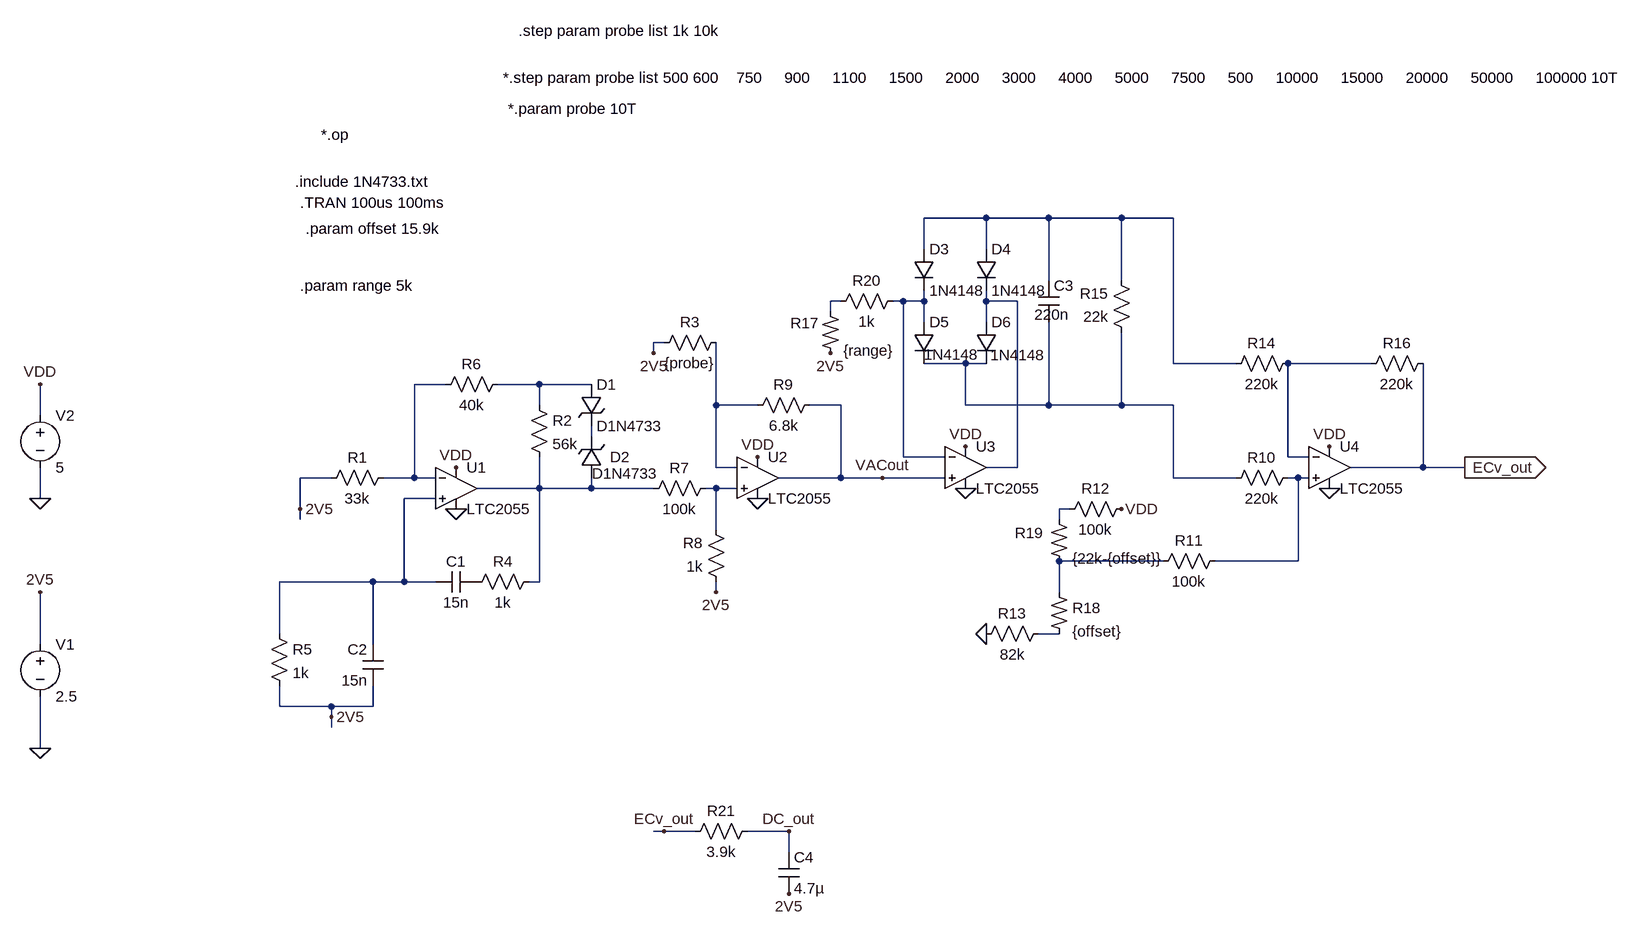
[diagram p0: schematic Conductivity5V.asc]
Conductivity5V.asc, the LTspice schematic file:
Version 4
SHEET 1 2084 992
WIRE 1120 -160 1024 -160
WIRE 1216 -160 1120 -160
WIRE 1328 -160 1216 -160
WIRE 1408 -160 1328 -160
WIRE 1024 -112 1024 -160
WIRE 1120 -112 1120 -160
WIRE 1216 -64 1216 -160
WIRE 1328 -64 1328 -160
WIRE 896 -32 880 -32
WIRE 992 -32 976 -32
WIRE 1024 -32 1024 -48
WIRE 1024 -32 992 -32
WIRE 1120 -32 1120 -48
WIRE 1168 -32 1120 -32
WIRE 880 -16 880 -32
WIRE 1024 0 1024 -32
WIRE 1120 0 1120 -32
WIRE 624 32 608 32
WIRE 608 48 608 32
WIRE 1088 64 1024 64
WIRE 1120 64 1088 64
WIRE 1408 64 1408 -160
WIRE 1504 64 1408 64
WIRE 1712 64 1584 64
WIRE 288 96 240 96
WIRE 432 96 368 96
WIRE 512 96 432 96
WIRE -336 128 -336 96
WIRE 432 128 432 96
WIRE 704 128 704 32
WIRE 768 128 704 128
WIRE 896 128 848 128
WIRE 1088 128 1088 64
WIRE 1216 128 1216 0
WIRE 1216 128 1088 128
WIRE 1328 128 1328 16
WIRE 1328 128 1216 128
WIRE 1408 128 1328 128
WIRE -336 144 -336 128
WIRE 512 176 512 160
WIRE 992 208 992 -32
WIRE 1056 208 992 208
WIRE 1584 208 1584 64
WIRE 1616 208 1584 208
WIRE 704 224 704 128
WIRE 736 224 704 224
WIRE 1168 224 1168 -32
WIRE 1168 224 1120 224
WIRE 1792 224 1792 64
WIRE 1792 224 1680 224
WIRE 1856 224 1792 224
WIRE 112 240 64 240
WIRE 240 240 240 96
WIRE 240 240 192 240
WIRE 272 240 240 240
WIRE 896 240 896 128
WIRE 896 240 800 240
WIRE 960 240 896 240
WIRE 1056 240 960 240
WIRE 1408 240 1408 128
WIRE 1504 240 1408 240
WIRE 1600 240 1584 240
WIRE 1616 240 1600 240
WIRE 432 256 432 208
WIRE 432 256 336 256
WIRE 512 256 512 240
WIRE 512 256 432 256
WIRE 608 256 512 256
WIRE 704 256 688 256
WIRE 736 256 704 256
WIRE -336 272 -336 224
WIRE 272 272 224 272
WIRE 64 288 64 240
WIRE 1248 288 1232 288
WIRE 64 304 64 288
WIRE 1232 304 1232 288
WIRE 704 320 704 256
WIRE 1392 368 1232 368
WIRE 1600 368 1600 240
WIRE 1600 368 1472 368
WIRE 176 400 32 400
WIRE 224 400 224 272
WIRE 224 400 176 400
WIRE 272 400 224 400
WIRE 432 400 432 256
WIRE 432 400 416 400
WIRE 704 416 704 400
WIRE 1232 416 1232 368
WIRE 32 480 32 400
WIRE 1232 480 1200 480
WIRE -336 496 -336 416
WIRE 176 496 176 400
WIRE 32 592 32 560
WIRE 112 592 32 592
WIRE 176 592 176 560
WIRE 176 592 112 592
WIRE 112 608 112 592
WIRE 112 624 112 608
WIRE -336 656 -336 576
WIRE 624 784 608 784
WIRE 672 784 624 784
WIRE 816 784 752 784
WIRE 816 816 816 784
FLAG 64 288 2V5
FLAG 112 608 2V5
FLAG 704 416 2V5
FLAG 608 48 2V5
FLAG -336 96 VDD
FLAG 304 224 VDD
FLAG 768 208 VDD
FLAG -336 272 0
FLAG 304 288 0
FLAG 768 272 0
FLAG 960 240 VACout
FLAG 1088 192 VDD
FLAG 1648 192 VDD
FLAG 1328 288 VDD
FLAG 1120 480 0
FLAG 1088 256 0
FLAG 1648 256 0
FLAG 1856 224 ECv_out
IOPIN 1856 224 Out
FLAG 880 48 2V5
FLAG 816 880 2V5
FLAG 624 784 ECv_out
FLAG 816 784 DC_out
FLAG -336 656 0
FLAG -336 416 2V5
DATAFLAG -336 128 "$"
DATAFLAG -336 128 "$"
SYMBOL res 208 224 R90
WINDOW 0 0 56 VBottom 2
WINDOW 3 32 56 VTop 2
SYMATTR InstName R1
SYMATTR Value 33k
SYMBOL res 416 112 R0
SYMATTR InstName R2
SYMATTR Value 56k
SYMBOL res 432 384 R90
WINDOW 0 0 56 VBottom 2
WINDOW 3 32 56 VTop 2
SYMATTR InstName R4
SYMATTR Value 1k
SYMBOL res 16 464 R0
SYMATTR InstName R5
SYMATTR Value 1k
SYMBOL cap 336 384 R90
WINDOW 0 0 32 VBottom 2
WINDOW 3 32 32 VTop 2
SYMATTR InstName C1
SYMATTR Value 15n
SYMBOL cap 192 560 R180
WINDOW 0 24 56 Left 2
WINDOW 3 24 8 Left 2
SYMATTR InstName C2
SYMATTR Value 15n
SYMBOL res 704 240 R90
WINDOW 0 0 56 VBottom 2
WINDOW 3 32 56 VTop 2
SYMATTR InstName R7
SYMATTR Value 100k
SYMBOL res 720 416 R180
WINDOW 0 36 76 Left 2
WINDOW 3 36 40 Left 2
SYMATTR InstName R8
SYMATTR Value 1k
SYMBOL res 752 144 R270
WINDOW 0 32 56 VTop 2
WINDOW 3 0 56 VBottom 2
SYMATTR InstName R9
SYMATTR Value 6.8k
SYMBOL zener 496 96 R0
SYMATTR InstName D1
SYMATTR Value D1N4733
SYMBOL zener 528 240 R180
WINDOW 0 -13 32 Right 2
WINDOW 3 15 7 Right 2
SYMATTR InstName D2
SYMATTR Value D1N4733
SYMBOL voltage -336 128 R0
SYMATTR InstName V2
SYMATTR Value 5
SYMBOL res 1600 224 R90
WINDOW 0 0 56 VBottom 2
WINDOW 3 32 56 VTop 2
SYMATTR InstName R10
SYMATTR Value 220k
SYMBOL res 1488 352 R90
WINDOW 0 0 56 VBottom 2
WINDOW 3 32 56 VTop 2
SYMATTR InstName R11
SYMATTR Value 100k
SYMBOL res 1344 272 R90
WINDOW 0 0 56 VBottom 2
WINDOW 3 32 56 VTop 2
SYMATTR InstName R12
SYMATTR Value 100k
SYMBOL res 1216 464 R90
WINDOW 0 0 56 VBottom 2
WINDOW 3 32 56 VTop 2
SYMATTR InstName R13
SYMATTR Value 82k
SYMBOL res 1600 48 R90
WINDOW 0 0 56 VBottom 2
WINDOW 3 32 56 VTop 2
SYMATTR InstName R14
SYMATTR Value 220k
SYMBOL res 1344 32 R180
WINDOW 0 36 76 Left 2
WINDOW 3 36 40 Left 2
SYMATTR InstName R15
SYMATTR Value 22k
SYMBOL res 1696 80 R270
WINDOW 0 32 56 VTop 2
WINDOW 3 0 56 VBottom 2
SYMATTR InstName R16
SYMATTR Value 220k
SYMBOL cap 1200 -64 R0
WINDOW 3 -6 53 Left 2
SYMATTR InstName C3
SYMATTR Value 220n
SYMBOL diode 1008 -112 R0
SYMATTR InstName D3
SYMATTR Value 1N4148
SYMBOL diode 1104 -112 R0
SYMATTR InstName D4
SYMATTR Value 1N4148
SYMBOL diode 1008 0 R0
WINDOW 3 16 50 Left 2
SYMATTR InstName D5
SYMATTR Value 1N4148
SYMBOL diode 1104 0 R0
WINDOW 3 22 51 Left 2
SYMATTR InstName D6
SYMATTR Value 1N4148
SYMBOL res2 864 -16 R0
WINDOW 0 -1 18 Right 2
SYMATTR InstName R17
SYMATTR Value {range}
SYMBOL res2 1216 416 R0
SYMATTR InstName R18
SYMATTR Value {offset}
SYMBOL res2 1216 304 R0
WINDOW 0 -52 21 Left 2
SYMATTR InstName R19
SYMATTR Value {22k-{offset}}
SYMBOL res 992 -48 R90
WINDOW 0 0 56 VBottom 2
WINDOW 3 32 56 VTop 2
SYMATTR InstName R20
SYMATTR Value 1k
SYMBOL res 720 16 R90
WINDOW 0 0 56 VBottom 2
WINDOW 3 32 56 VTop 2
SYMATTR InstName R3
SYMATTR Value {probe}
SYMBOL res 272 112 R270
WINDOW 0 32 56 VTop 2
WINDOW 3 0 56 VBottom 2
SYMATTR InstName R6
SYMATTR Value 40k
SYMBOL res 768 768 R90
WINDOW 0 0 56 VBottom 2
WINDOW 3 32 56 VTop 2
SYMATTR InstName R21
SYMATTR Value 3.9k
SYMBOL cap 800 816 R0
SYMATTR InstName C4
SYMATTR Value 4.7µ
SYMBOL Opamps/LTC2055 304 256 R0
SYMATTR InstName U1
SYMBOL Opamps/LTC2055 768 240 R0
SYMATTR InstName U2
SYMBOL Opamps/LTC2055 1088 224 R0
SYMATTR InstName U3
SYMBOL Opamps/LTC2055 1648 224 R0
SYMATTR InstName U4
SYMBOL voltage -336 480 R0
SYMATTR InstName V1
SYMATTR Value 2.5
TEXT 56 -216 Left 2 !.include 1N4733.txt
TEXT 64 -184 Left 2 !.TRAN 100us 100ms
TEXT 72 -144 Left 2 !.param offset 15.9k
TEXT 376 -376 Left 2 !*.step param probe list 500 600	750	 900 	1100 	1500	 2000 	3000	 4000	 5000	 7500	 500	 10000 	15000	 20000	 50000	 100000 10T
TEXT 64 -56 Left 2 !.param range 5k
TEXT 96 -288 Left 2 !*.op
TEXT 384 -328 Left 2 !*.param probe 10T
TEXT 400 -448 Left 2 !.step param probe list 1k 10k

The netlist it stands for:
* Conductivity5V.asc
R1 N007 2V5 33k
R2 N008 N012 56k
R4 N012 P001 1k
R5 N014 2V5 1k
C1 P001 N014 15n
C2 2V5 N014 15n
R7 N013 N012 100k
R8 2V5 N013 1k
R9 N009 VACout 6.8k
D1 N008 N010 D1N4733
D2 N012 N010 D1N4733
V2 VDD 0 5
R10 N011 N005 220k
R11 N011 N016 100k
R12 VDD N015 100k
R13 N017 0 82k
R14 N006 N001 220k
R15 N005 N001 22k
R16 N006 ECv_out 220k
C3 N001 N005 220n
D3 N001 N003 1N4148
D4 N001 N004 1N4148
D5 N003 N005 1N4148
D6 N004 N005 1N4148
R17 N002 2V5 {range}
R18 N016 N017 {offset}
R19 N015 N016 {22k-{offset}}
R20 N003 N002 1k
R3 N009 2V5 {probe}
R6 N007 N008 40k
R21 DC_out ECv_out 3.9k
C4 DC_out 2V5 4.7µ
XU1 N014 N007 N012 VDD 0 LTC2054  ; LTC2055, pins In+ In- OUT V+ V-
XU2 N013 N009 VACout VDD 0 LTC2054  ; LTC2055, pins In+ In- OUT V+ V-
XU3 VACout N003 N004 VDD 0 LTC2054  ; LTC2055, pins In+ In- OUT V+ V-
XU4 N011 N006 ECv_out VDD 0 LTC2054  ; LTC2055, pins In+ In- OUT V+ V-
V1 2V5 0 2.5
.model D D
.lib standard.dio
.include 1N4733.txt
.TRAN 100us 100ms
.param offset 15.9k
*.step param probe list 500 600	750	 900 	1100 	1500	 2000 	3000	 4000	 5000	 7500	 500	 10000 	15000	 20000	 50000	 100000 10T
.param range 5k
*.op
*.param probe 10T
.step param probe list 1k 10k
.lib LTC2.lib
.backanno
.end